# EAGLE schematic schematic (EAGLE 9.6.2)
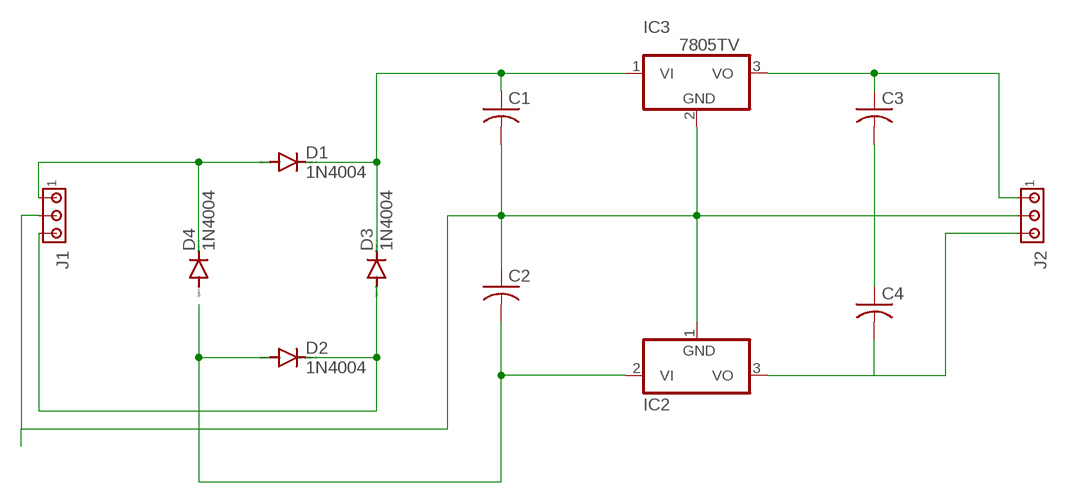
[diagram p0: schematic, sheet 1]

## Parts
C1  C-US102-064X133  [C102-064X133]
C2  C-US102-064X133  [C102-064X133]
C3  C-US102-064X133  [C102-064X133]
C4  C-US102-064X133  [C102-064X133]
D1  1N4004  [DO41-10]
D2  1N4004  [DO41-10]
D3  1N4004  [DO41-10]
D4  1N4004  [DO41-10]
IC2  7908T  [TO220H]
IC3  7805TV  [TO220V]
J1  MTA03-100  [10X03MTA]
J2  MTA03-100  [10X03MTA]

## Nets
N$1: D1.A D4.C J1.1
N$2: C2.2 D2.A IC2.2(VI)
N$3: D2.C D3.A J1.3
N$4: C1.1 D1.C D3.C IC3.1(VI)
N$5: C1.2 C2.1 IC2.1(GND) IC3.2(GND) J1.2 J2.2
N$6: C3.1 IC3.3(VO) J2.1
N$7: C3.2 C4.1
N$8: C4.2
N$10: IC2.3(VO) J2.3
Unconnected: D4.A

## Library data of the parts
C1-C4 = rcl:C-US: CAPACITOR, American symbol; SPICEPREFIX: C
D1-D4 = diode:1N4004: DIODE general purpose rectifier, 1 A
IC2 = linear:79*: Negative VOLTAGE REGULATOR
IC3 = linear:78*: Positive VOLTAGE REGULATOR Source: http://cache.national.com/ds/LM/LM78L05.pdf http://www.fairchildsemi.com/ds/LM/LM7805.pdf
J1 J2 = con-amp:MTA03-100: AMP connector